# Altium project PIC16f887IP.PrjPCB
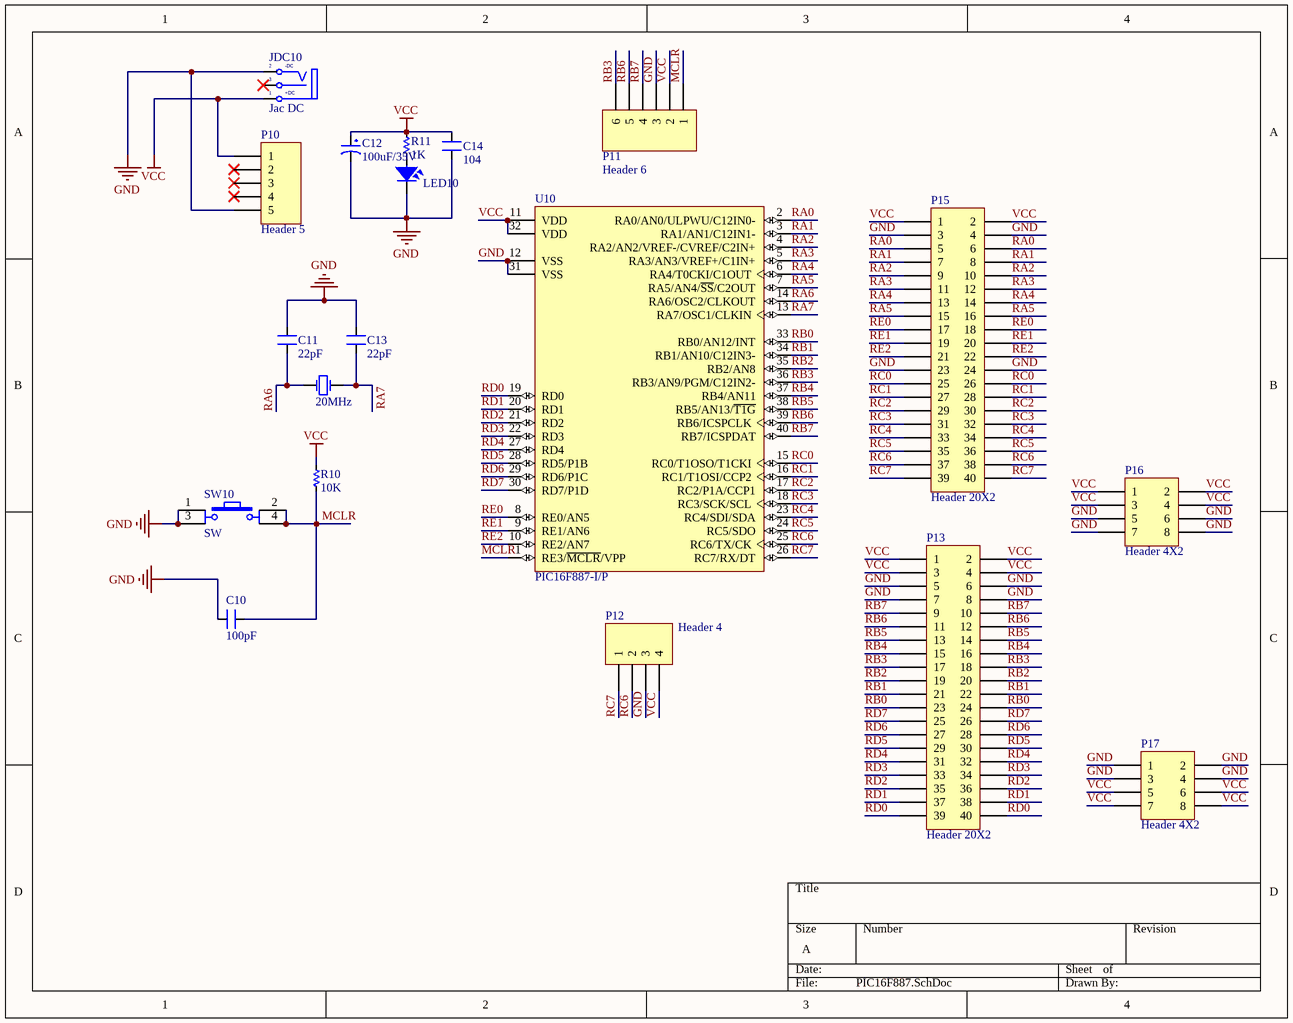
[diagram p0: PIC16F887.SchDoc]
1 sheet, 19 parts. Net scope: global (net labels, ports and power ports of the same name join across sheets).
Board files: PCB1.PcbDoc, output.PcbDoc, Final.PcbDoc, Tesst.PcbDoc

## Sheet PIC16F887.SchDoc
size A

### Parts
C10  100pF  [CN1]
C11  22pF  [CN1]
C12  100uF/35V  [CP1.5/3.4]
C13  22pF  [CN1]
C14  104  [CN1.5]
JDC10  Jac DC  [DC-IN]
LED10  LED  [LED-1206-Blue]  (value not drawn)
P10  Header 5  [HDR1X5]
P11  Header 6  [HDR1X6]
P12  Header 4  [HDR1X4]
P13  Header 20X2  [HDR2X20]
P15  Header 20X2  [HDR2X20]
P16  Header 4X2  [HDR2X4]
P17  Header 4X2  [HDR2X4]
R10  10K  [RES-SMD-1206]
R11  1K  [RES-SMD-1206]
SW10  SW  [SW4]
U10  PIC16F887-I/P  [PDIP600-P40]
Y10  20MHz  [XTAL]

### Nets
GND: C10.2 C11.2 C12.2 C13.2 C14.1 JDC10.2(TN) LED10.2 P10.5 P11.3 P12.3 P13.5 P13.6 P13.7 P13.8 P15.3 P15.4 P15.23 P15.24 P16.5 P16.6 P16.7 P16.8 P17.1 P17.2 P17.3 P17.4 SW10.1 SW10.3 U10.12(VSS) U10.31(VSS)
VCC: C12.1 C14.2 JDC10.1(T) P10.1 P11.2 P12.4 P13.1 P13.2 P13.3 P13.4 P15.1 P15.2 P16.1 P16.2 P16.3 P16.4 P17.5 P17.6 P17.7 P17.8 R10.1 R11.1 U10.11(VDD) U10.32(VDD)
MCLR: C10.1 P11.1 R10.2 SW10.2 SW10.4 U10.1(RE3/~{MCLR}/VPP)
RA0: P15.5 P15.6 U10.2(RA0/AN0/ULPWU/C12IN0-)
RA1: P15.7 P15.8 U10.3(RA1/AN1/C12IN1-)
RA2: P15.9 P15.10 U10.4(RA2/AN2/VREF-/CVREF/C2IN+)
RA3: P15.11 P15.12 U10.5(RA3/AN3/VREF+/C1IN+)
RA4: P15.13 P15.14 U10.6(RA4/T0CKI/C1OUT)
RA5: P15.15 P15.16 U10.7(RA5/AN4/~{SS}/C2OUT)
RA6: C11.1 U10.14(RA6/OSC2/CLKOUT) Y10.1(OSC1)
RA7: C13.1 U10.13(RA7/OSC1/CLKIN) Y10.2(OSC2)
RB0: P13.23 P13.24 U10.33(RB0/AN12/INT)
RB1: P13.21 P13.22 U10.34(RB1/AN10/C12IN3-)
RB2: P13.19 P13.20 U10.35(RB2/AN8)
RB3: P11.6 P13.17 P13.18 U10.36(RB3/AN9/PGM/C12IN2-)
RB4: P13.15 P13.16 U10.37(RB4/AN11)
RB5: P13.13 P13.14 U10.38(RB5/AN13/~{T1G})
RB6: P11.5 P13.11 P13.12 U10.39(RB6/ICSPCLK)
RB7: P11.4 P13.9 P13.10 U10.40(RB7/ICSPDAT)
RC0: P15.25 P15.26 U10.15(RC0/T1OSO/T1CKI)
RC1: P15.27 P15.28 U10.16(RC1/T1OSI/CCP2)
RC2: P15.29 P15.30 U10.17(RC2/P1A/CCP1)
RC3: P15.31 P15.32 U10.18(RC3/SCK/SCL)
RC4: P15.33 P15.34 U10.23(RC4/SDI/SDA)
RC5: P15.35 P15.36 U10.24(RC5/SDO)
RC6: P12.2 P15.37 P15.38 U10.25(RC6/TX/CK)
RC7: P12.1 P15.39 P15.40 U10.26(RC7/RX/DT)
RD0: P13.39 P13.40 U10.19(RD0)
RD1: P13.37 P13.38 U10.20(RD1)
RD2: P13.35 P13.36 U10.21(RD2)
RD3: P13.33 P13.34 U10.22(RD3)
RD4: P13.31 P13.32 U10.27(RD4)
RD5: P13.29 P13.30 U10.28(RD5/P1B)
RD6: P13.27 P13.28 U10.29(RD6/P1C)
RD7: P13.25 P13.26 U10.30(RD7/P1D)
RE0: P15.17 P15.18 U10.8(RE0/AN5)
RE1: P15.19 P15.20 U10.9(RE1/AN6)
RE2: P15.21 P15.22 U10.10(RE2/AN7)
NetLED10_1: LED10.1 R11.2

Not connected (* = marked no-connect by the designer): JDC10 3(S)*; P10 2* 3* 4*

### Notes on the sheet
- (in symbol DCIN) -DC; +DC

### Library data of the parts
C10 = CN1: Cap np  1pF - 472pF; Value: 100pF
C11 C13 = CN1: Cap np  1pF - 472pF; Value: 100pF
C12 = CP3: Cap 100uF/35V - 470uF/16V; Value: 100uF/35V/50V; Description 1: 1000uF/6,3V - 470uF/16V - 330uF - 25V; Description 2: 220uF/35V - 100uF/50V - 63V - 4,7uF/200V; Description 3: 22uF => 33uF100V - 3,3uF => 4,7uF/250V; Description 4: 2,2uF =>3,3uF/350 - 2,2uF/400V - 1uF/450V
C14 = CN1.5: Cap np 682pF => 104pF; Value: 0.01uF
JDC10 = DCIN: Jac DC input; Value: Jac DC
LED10 = LED SMD: Value: LED 3 - 5 ly 2 Colour
P10 = Header 5: Header, 5-Pin; LatestRevisionDate: 17-Jul-2002; LatestRevisionNote: Re-released for DXP Platform.; Publisher: Altium Limited
P11 = Header 6: Header, 6-Pin; LatestRevisionDate: 17-Jul-2002; LatestRevisionNote: Re-released for DXP Platform.; Publisher: Altium Limited
P12 = Header 4: Header, 4-Pin; LatestRevisionDate: 17-Jul-2002; LatestRevisionNote: Re-released for DXP Platform.; Publisher: Altium Limited
P13 P15 = Header 20X2: Header, 20-Pin, Dual row; LatestRevisionDate: 17-Jul-2002; LatestRevisionNote: Re-released for DXP Platform.; Publisher: Altium Limited
P16 P17 = Header 4X2: Header, 4-Pin, Dual row; LatestRevisionDate: 17-Jul-2002; LatestRevisionNote: Re-released for DXP Platform.; Publisher: Altium Limited
R10 R11 = Res-SMD: Resistor; Manufacturer: Generic Components; Class: Passive; Published: 08/06/2000; Publisher: Altium Hobart Technology Centre
SW10 = SW4: Switch button 4 pin; Value: Button chip 4 pin
U10 = PIC16F887-I/P: Flash-Based, 8-Bit CMOS Microcontroller with nanoWatt Technology, 8K (x14-Bit words) Program Memory, 624 Bytes Data Memory, 35 I/O pins, 40-Pin PDIP, Standard VDD Range, Industrial Temperature; Published: 29-Jan-2009; LatestRevisionDate: 02-Dec-2009; LatestRevisionNote: Updated datasheet to version revF, Apr-2009.; DatasheetVersion: revF, Apr-2009; PackageVersion: revBB, Aug-2009; PackageReference: PDIP600-P40; Publisher: Altium Limited; PackageDescription: 40-Lead Plastic Dual In-Line (P) - 600 mil Body [PDIP]; Supplier 1: Digi-Key; Supplier Part Number 1: PIC16F887-I/P-ND; Supplier 2: Farnell; Supplier Part Number 2: 1439541; ComponentLink1Description: Datasheet; ComponentLink1URL: http://ww1.microchip.com/downloads/en/DeviceDoc/41291F.pdf; ComponentLink2Description: Packaging Specification; ComponentLink2URL: http://www.microchip.com/stellent/groups/techpub_sg/documents/packagingspec/en012702.pdf; ComponentLink3Description: Microchip.com Home; ComponentLink3URL: http://www.microchip.com/
Y10 = XTAL: Crystal Oscillator; Published: 8-Jun-2000; LatestRevisionDate: 17-Jul-2002; LatestRevisionNote: Re-released for DXP Platform.; PackageReference: R38; Publisher: Altium Limited